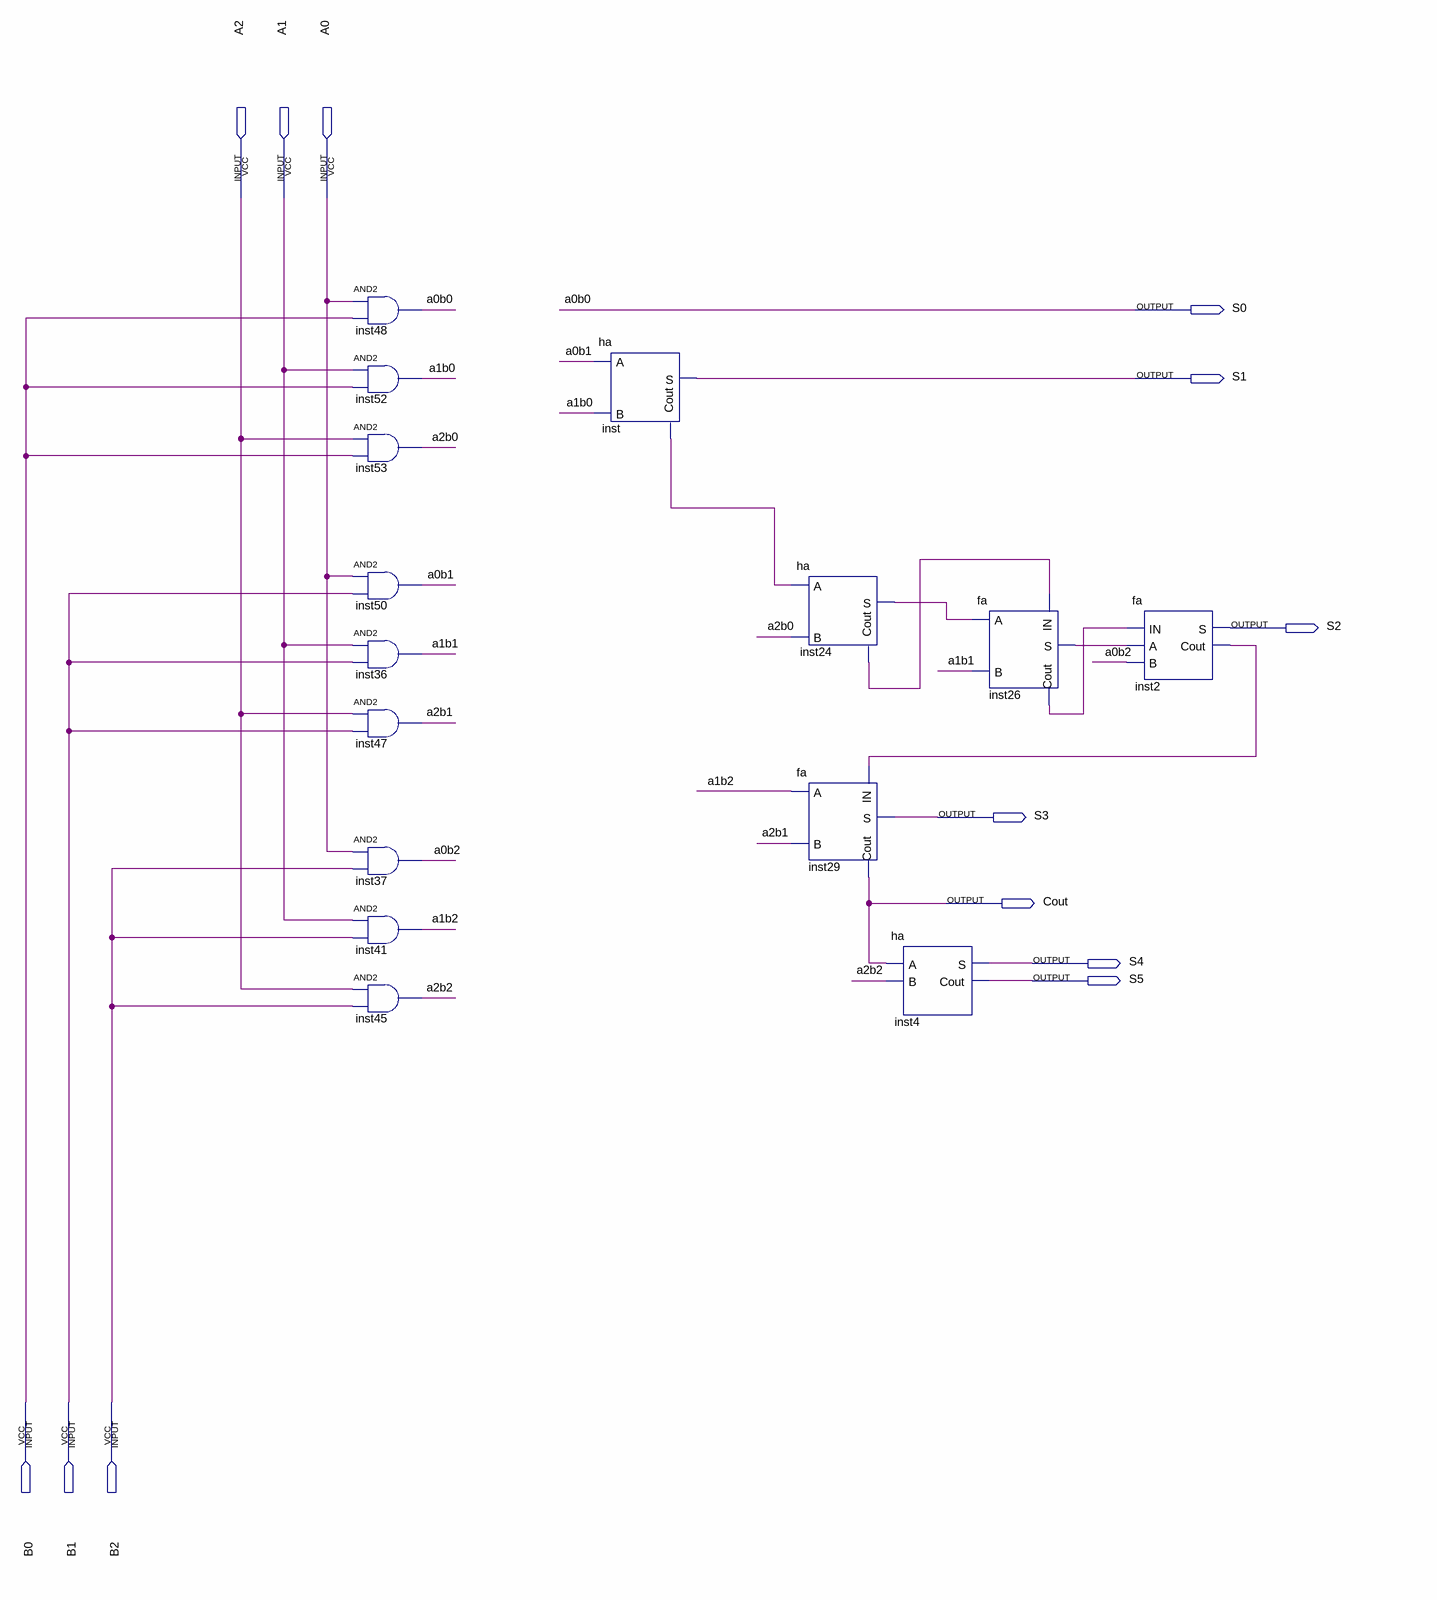
[diagram p0: schematic sheet]
// Quartus schematic mult_3.bdf as structural Verilog: 15 symbols, 13 pins
module mult_3 (
  input  A2,
  input  A1,
  input  A0,
  input  B0,
  input  B1,
  input  B2,
  output S0,
  output S1,
  output S2,
  output S3,
  output Cout,
  output S4,
  output S5
);

  wire a0b1, a0b2, a1b0, a1b1, a1b2, a2b0, a2b1, a2b2, inst2_cout, inst24_cout, inst24_s, inst26_cout,
       inst26_s, inst_cout;

  and inst48 (S0, A0, B0);
  and inst52 (a1b0, A1, B0);
  and inst53 (a2b0, A2, B0);
  and inst50 (a0b1, A0, B1);
  and inst36 (a1b1, A1, B1);
  and inst47 (a2b1, A2, B1);
  and inst37 (a0b2, A0, B2);
  and inst41 (a1b2, A1, B2);
  and inst45 (a2b2, A2, B2);
  ha inst (.A(a0b1), .B(a1b0), .S(S1), .Cout(inst_cout));
  ha inst24 (.A(inst_cout), .B(a2b0), .S(inst24_s), .Cout(inst24_cout));
  fa inst29 (.IN(inst2_cout), .A(a1b2), .B(a2b1), .S(S3), .Cout(Cout));
  ha inst4 (.A(Cout), .B(a2b2), .S(S4), .Cout(S5));
  fa inst26 (.IN(inst24_cout), .A(inst24_s), .B(a1b1), .S(inst26_s), .Cout(inst26_cout));
  fa inst2 (.IN(inst26_cout), .A(inst26_s), .B(a0b2), .S(S2), .Cout(inst2_cout));

  // Other names for the same wires on the sheet: a0b0 = S0
endmodule
